# EAGLE design stm32_StepInveter_1904_01 (EAGLE 6.1)

## Sheet 1 of 4
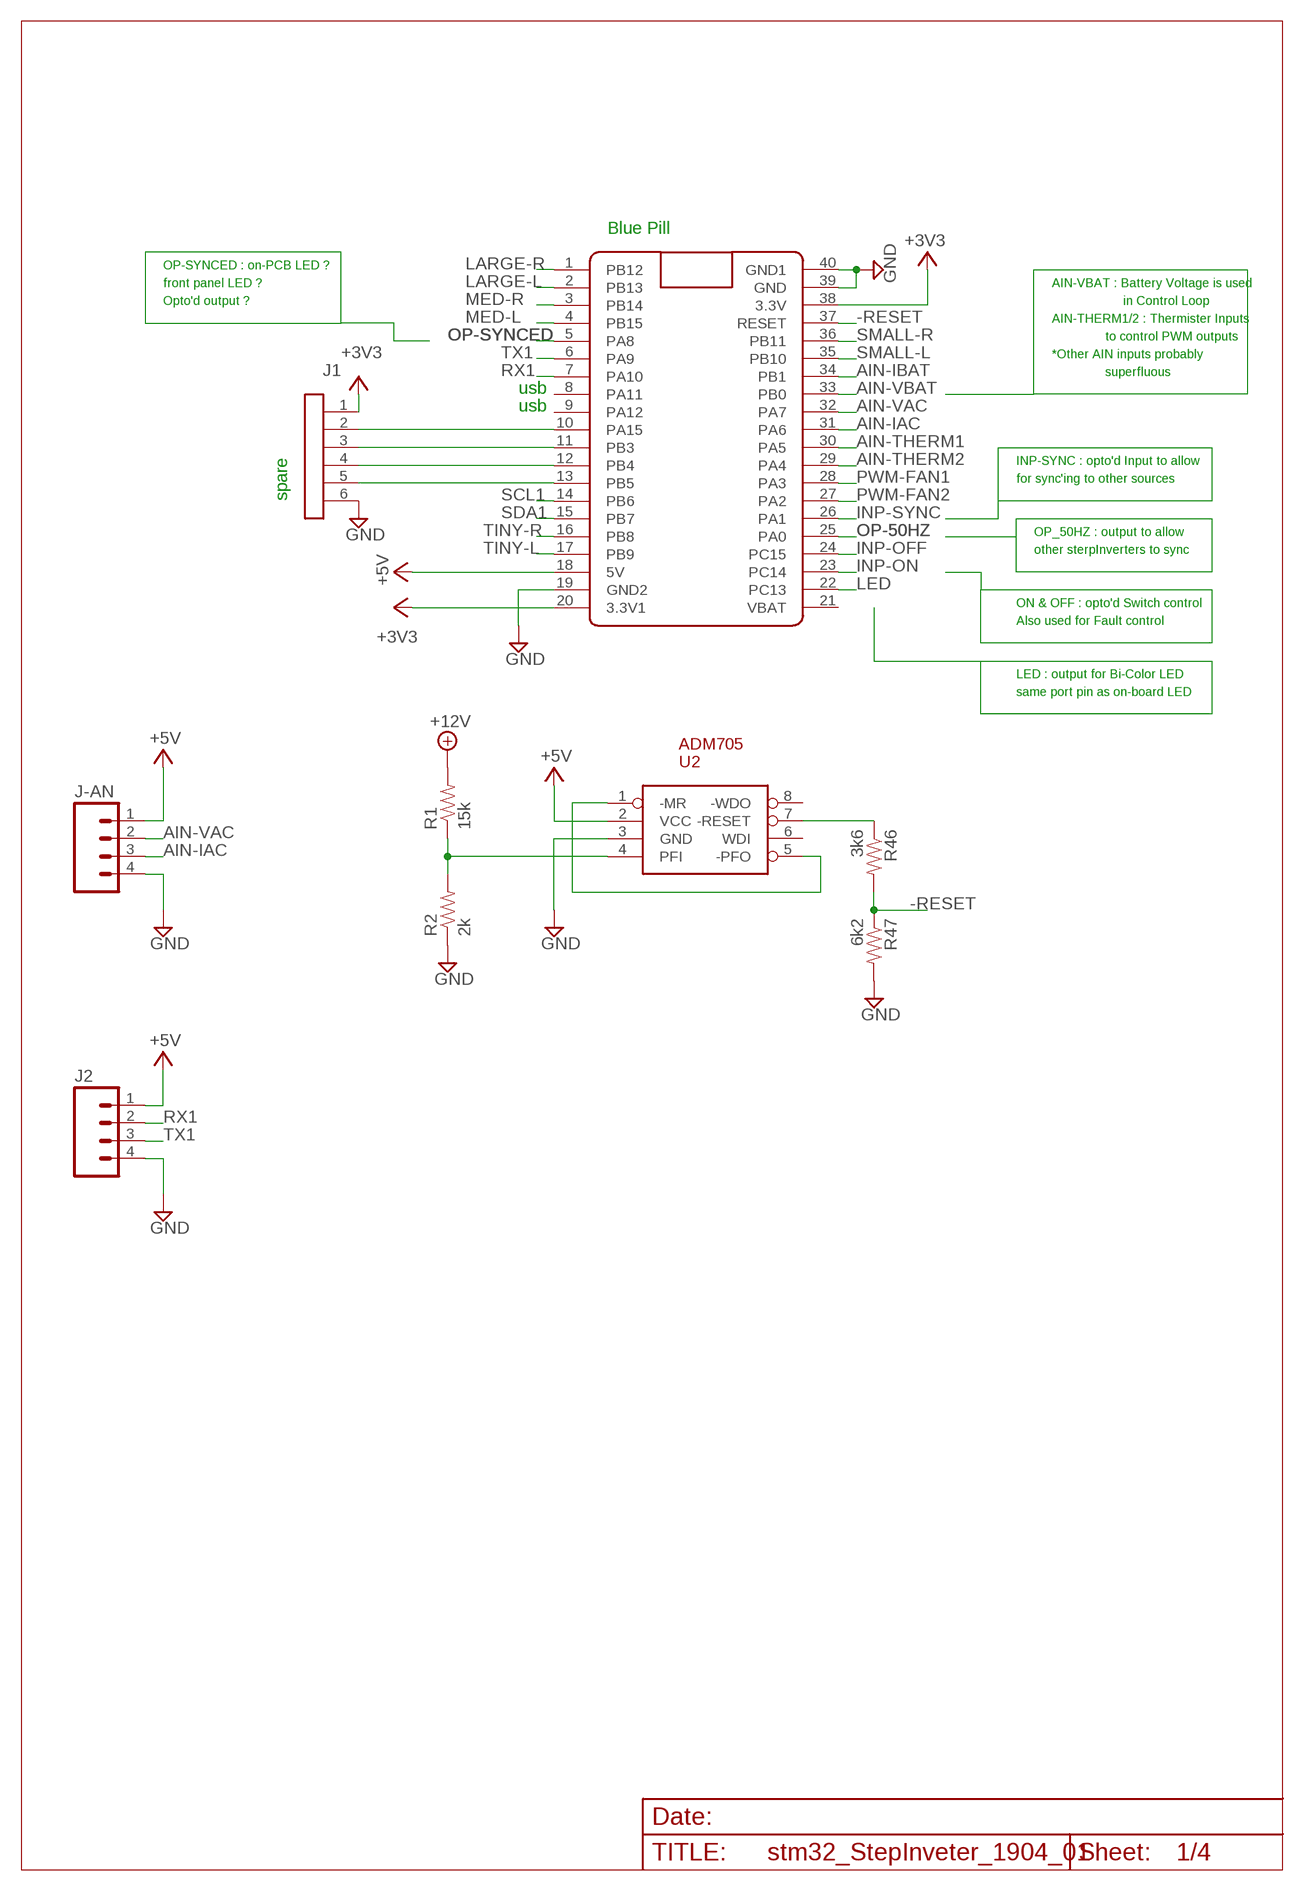
[diagram p0: schematic, sheet 1]

### Parts
J1  SIL-6  [SIL6]
J2  SIL4  [SIL4]
J-AN  SIL4  [SIL4]
R1  15k  R4  [AXIAL-0.4]
R2  2k  R4  [AXIAL-0.4]
R46  3k6  R4  [AXIAL-0.4]
R47  6k2  R4  [AXIAL-0.4]
U2  ADM705  [DIL08]
U$1  BLUE_PILL  [BLUE_PILL_CLEAN]

### Nets
+3V3: J1.1 U$1.20(3.3V1) U$1.38(3.3V) ; also sheet 3
+5V: J2.1 J-AN.1 U2.2(VCC) U$1.18(5V) ; also sheet 2,3,4
+12V: R1.P$2 ; also sheet 3
-RESET: R46.P$2 R47.P$1 U$1.37(RESET)
AIN-IAC: J-AN.3 U$1.31(PA6)
AIN-IBAT: U$1.34(PB1) ; also sheet 3
AIN-THERM1: U$1.30(PA5) ; also sheet 3
AIN-THERM2: U$1.29(PA4) ; also sheet 3
AIN-VAC: J-AN.2 U$1.32(PA7)
AIN-VBAT: U$1.33(PB0) ; also sheet 3
GND: J1.6 J2.4 J-AN.4 R2.P$1 R47.P$2 U2.3(GND) U$1.19(GND2) U$1.39(GND) U$1.40(GND1) ; also sheet 2,3,4
INP-OFF: U$1.24(PC15) ; also sheet 3
INP-ON: U$1.23(PC14) ; also sheet 3
INP-SYNC: U$1.26(PA1) ; also sheet 3
LARGE-L: U$1.2(PB13) ; also sheet 2
LARGE-R: U$1.1(PB12) ; also sheet 2
LED: U$1.22(PC13) ; also sheet 4
MED-L: U$1.4(PB15) ; also sheet 2
MED-R: U$1.3(PB14) ; also sheet 2
N$1: J1.2 U$1.10(PA15)
N$2: J1.3 U$1.11(PB3)
N$3: J1.4 U$1.12(PB4)
N$4: J1.5 U$1.13(PB5)
N$5: U2.1(-MR) U2.5(-PFO)
N$6: R1.P$1 R2.P$2 U2.4(PFI)
N$77: R46.P$1 U2.7(-RESET)
OP-50HZ: U$1.25(PA0) ; also sheet 4
OP-SYNCED: U$1.5(PA8) ; also sheet 4
PWM-FAN1: U$1.28(PA3) ; also sheet 4
PWM-FAN2: U$1.27(PA2) ; also sheet 4
RX1: J2.2 U$1.7(PA10)
SCL1: U$1.14(PB6)
SDA1: U$1.15(PB7)
SMALL-L: U$1.35(PB10) ; also sheet 2
SMALL-R: U$1.36(PB11) ; also sheet 2
TINY-L: U$1.17(PB9) ; also sheet 2
TINY-R: U$1.16(PB8) ; also sheet 2
TX1: J2.3 U$1.6(PA9)
Unconnected: U2.6(WDI) U2.8(-WDO) U$1.8(PA11) U$1.9(PA12) U$1.21(VBAT)

### Notes on the sheet
- Blue Pill
- OP-SYNCED : on-PCB LED ?
- front panel LED ? | AIN-VBAT : Battery Voltage is used
- Opto'd output ? | in Control Loop
- AIN-THERM1/2 : Thermister Inputs
- to control PWM outputs
- *Other AIN inputs probably
- superfluous
- usb
- usb
- INP-SYNC : opto'd Input to allow
- for sync'ing to other sources
- spare
- OP_50HZ : output to allow
- other sterpInverters to sync
- ON & OFF : opto'd Switch control
- Also used for Fault control
- LED : output for Bi-Color LED
- same port pin as on-board LED

## Sheet 2 of 4
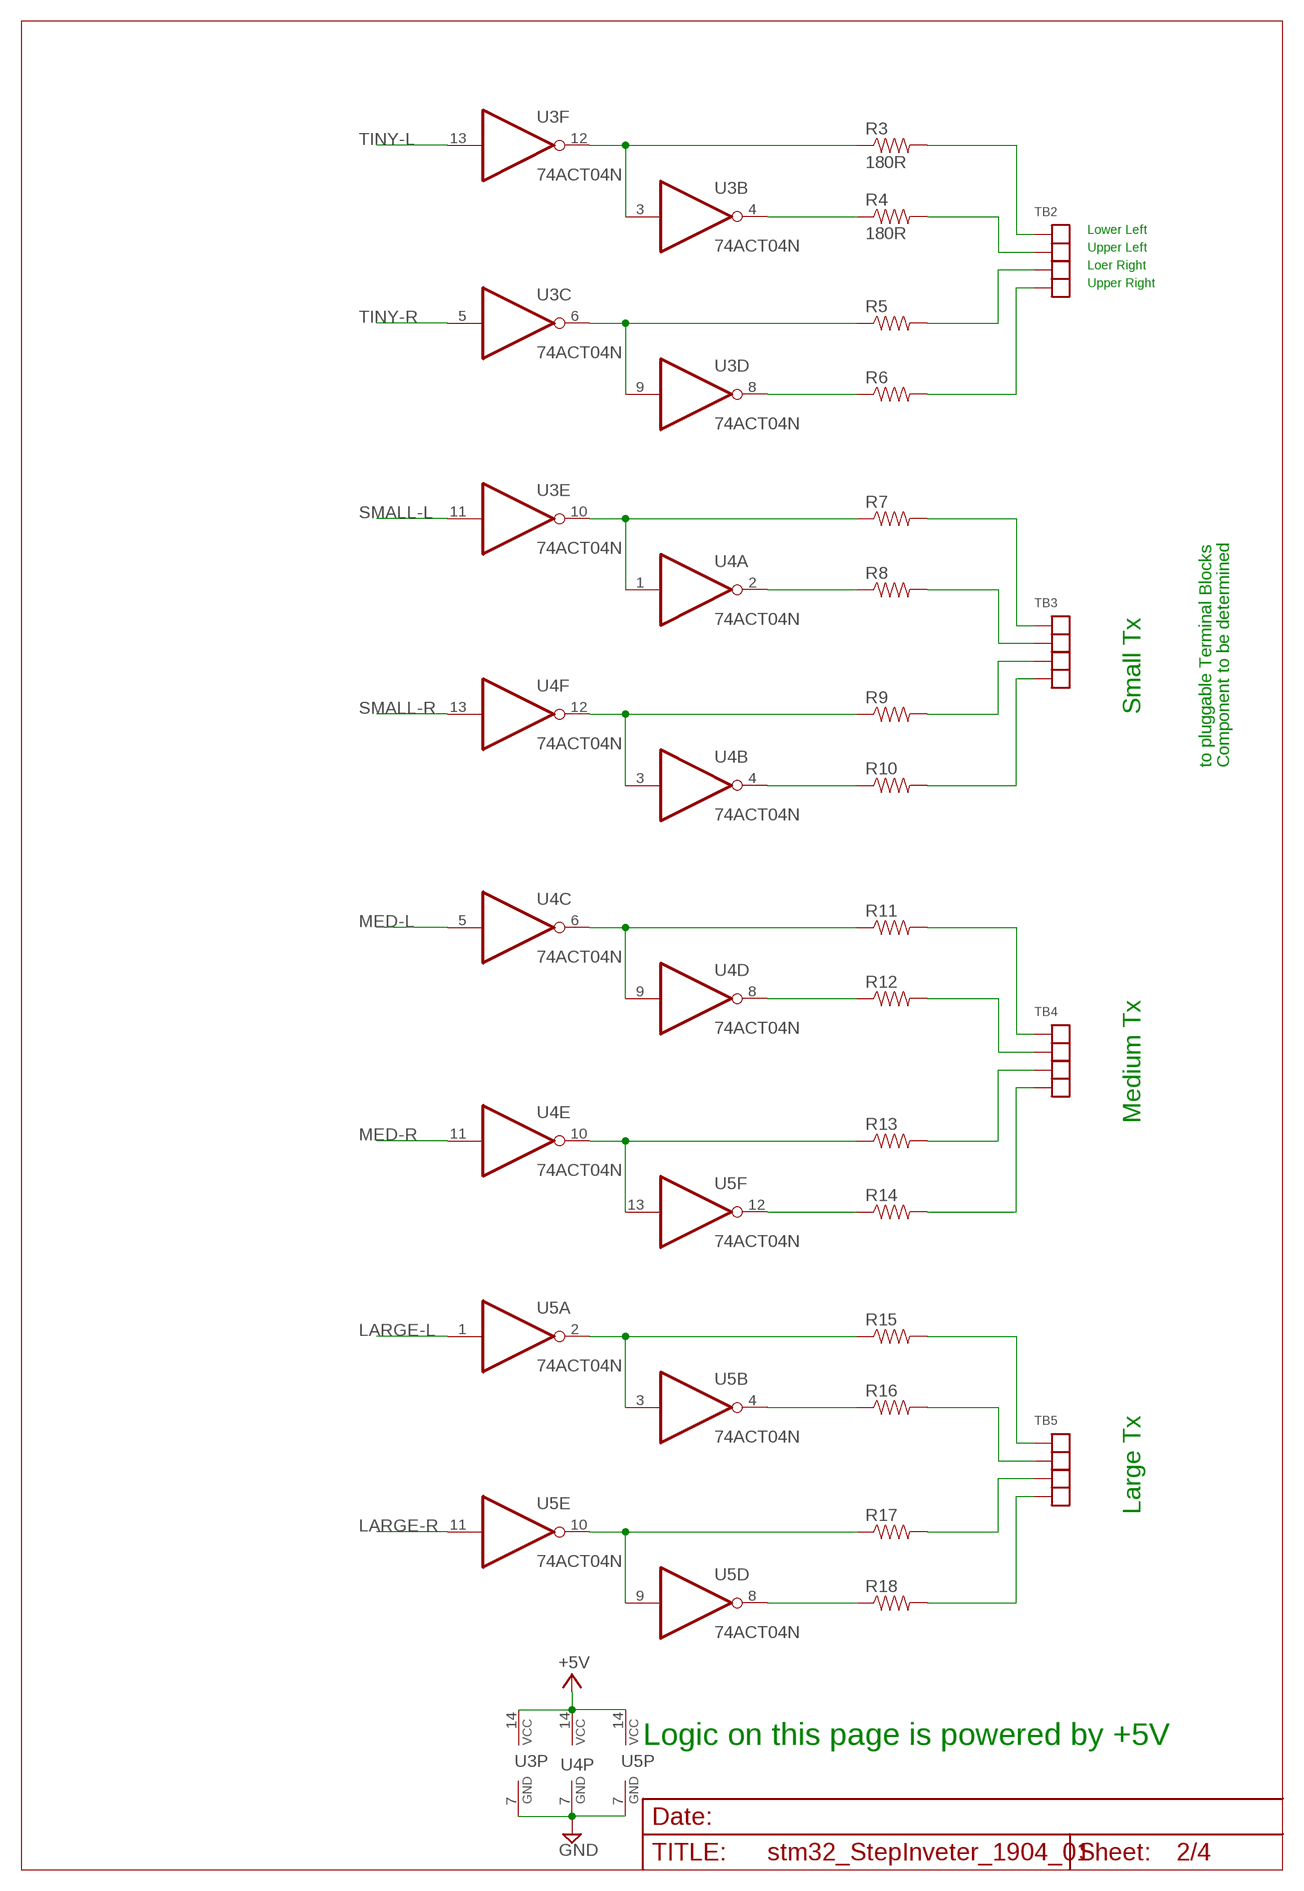
[diagram p1: schematic, sheet 2]

### Parts
R3  180R  R4  [AXIAL-0.4]
R4  180R  R4  [AXIAL-0.4]
R5  R4  [AXIAL-0.4]
R6  R4  [AXIAL-0.4]
R7  R4  [AXIAL-0.4]
R8  R4  [AXIAL-0.4]
R9  R4  [AXIAL-0.4]
R10  R4  [AXIAL-0.4]
R11  R4  [AXIAL-0.4]
R12  R4  [AXIAL-0.4]
R13  R4  [AXIAL-0.4]
R14  R4  [AXIAL-0.4]
R15  R4  [AXIAL-0.4]
R16  R4  [AXIAL-0.4]
R17  R4  [AXIAL-0.4]
R18  R4  [AXIAL-0.4]
TB2  TB4381_SIL  [TB-381-SIL-4P]
TB3  TB4381_SIL  [TB-381-SIL-4P]
TB4  TB4381_SIL  [TB-381-SIL-4P]
TB5  TB4381_SIL  [TB-381-SIL-4P]
U3  74ACT04N  [DIL14]
U4  74ACT04N  [DIL14]
U5  74ACT04N  [DIL14]

### Nets
+5V: U3.14(P:VCC) U4.14(P:VCC) U5.14(P:VCC) ; also sheet 1,3,4
GND: U3.7(P:GND) U4.7(P:GND) U5.7(P:GND) ; also sheet 1,3,4
LARGE-L: U5.1(A:I) ; also sheet 1
LARGE-R: U5.11(E:I) ; also sheet 1
MED-L: U4.5(C:I) ; also sheet 1
MED-R: U4.11(E:I) ; also sheet 1
N$15: R3.P$1 U3.3(B:I) U3.12(F:O)
N$16: R4.P$1 U3.4(B:O)
N$17: R5.P$1 U3.6(C:O) U3.9(D:I)
N$18: R6.P$1 U3.8(D:O)
N$19: R7.P$1 U3.10(E:O) U4.1(A:I)
N$20: R8.P$1 U4.2(A:O)
N$21: R9.P$1 U4.3(B:I) U4.12(F:O)
N$22: R10.P$1 U4.4(B:O)
N$23: R11.P$1 U4.6(C:O) U4.9(D:I)
N$24: R12.P$1 U4.8(D:O)
N$25: R13.P$1 U4.10(E:O) U5.13(F:I)
N$26: R14.P$1 U5.12(F:O)
N$27: R15.P$1 U5.2(A:O) U5.3(B:I)
N$28: R16.P$1 U5.4(B:O)
N$29: R17.P$1 U5.9(D:I) U5.10(E:O)
N$30: R18.P$1 U5.8(D:O)
N$40: R3.P$2 TB2.1 TB2.11
N$62: R4.P$2 TB2.2 TB2.12
N$63: R5.P$2 TB2.3 TB2.13
N$64: R6.P$2 TB2.4 TB2.14
N$65: R7.P$2 TB3.1 TB3.11
N$66: R8.P$2 TB3.2 TB3.12
N$67: R9.P$2 TB3.3 TB3.13
N$68: R10.P$2 TB3.4 TB3.14
N$69: R11.P$2 TB4.1 TB4.11
N$70: R12.P$2 TB4.2 TB4.12
N$71: R13.P$2 TB4.3 TB4.13
N$72: R14.P$2 TB4.4 TB4.14
N$73: R15.P$2 TB5.1 TB5.11
N$74: R16.P$2 TB5.2 TB5.12
N$75: R17.P$2 TB5.3 TB5.13
N$76: R18.P$2 TB5.4 TB5.14
SMALL-L: U3.11(E:I) ; also sheet 1
SMALL-R: U4.13(F:I) ; also sheet 1
TINY-L: U3.13(F:I) ; also sheet 1
TINY-R: U3.5(C:I) ; also sheet 1

### Notes on the sheet
- Lower Left
- Upper Left
- Loer Right
- Upper Right
- Small Tx
- to pluggable Terminal Blocks | Component to be determined
- Medium Tx
- Large Tx
- Logic on this page is powered by +5V

## Sheet 3 of 4
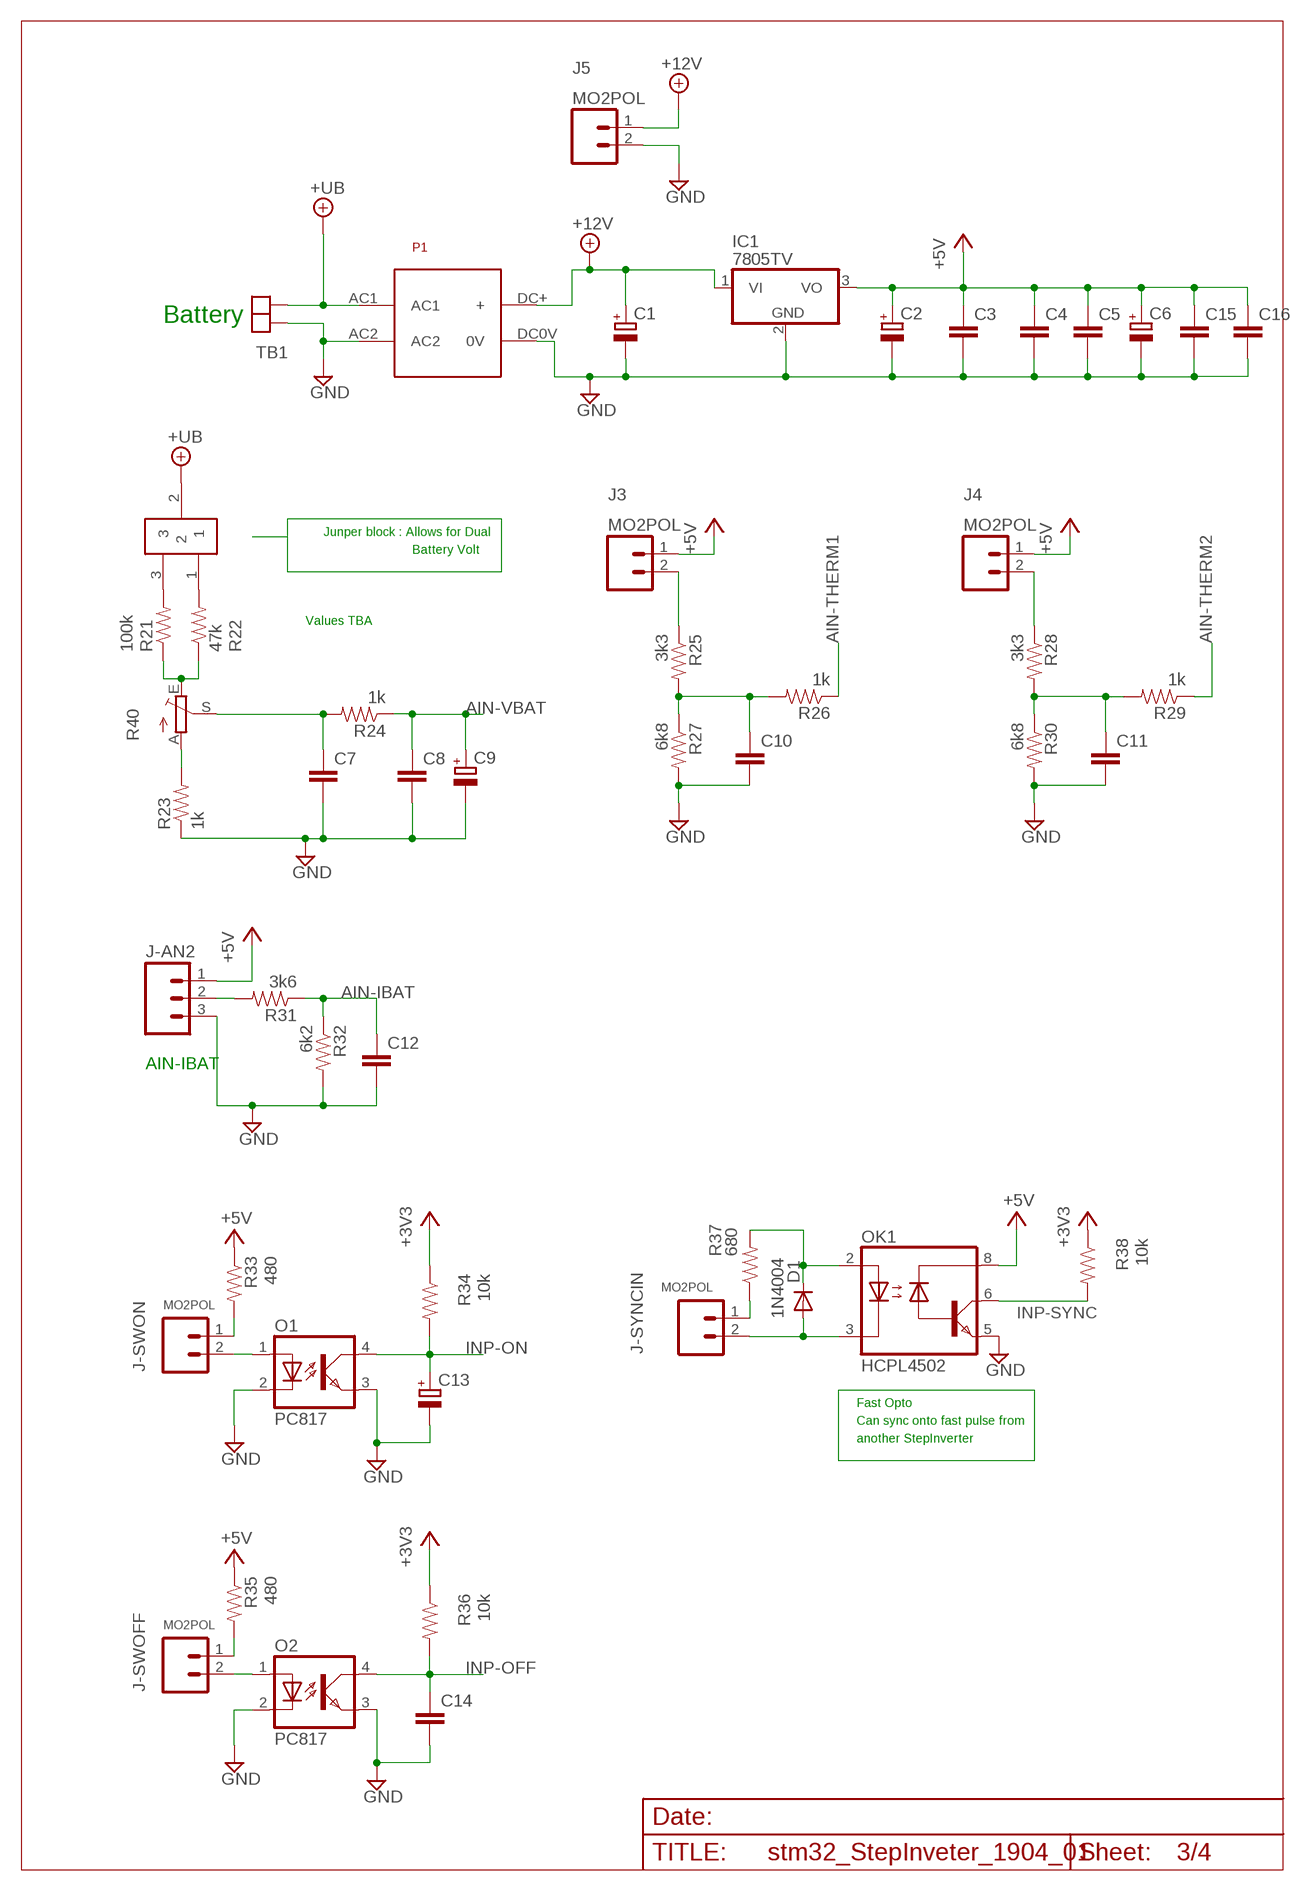
[diagram p2: schematic, sheet 3]

### Parts
C1  CPOL-EUE5-8.5  [E5-8,5]
C2  CPOL-EUE2.5-5  [E2,5-5]
C3  BCAP  [BCAP]
C4  BCAP  [BCAP]
C5  BCAP  [BCAP]
C6  CPOL-EUE2.5-5  [E2,5-5]
C7  BCAP  [BCAP]
C8  BCAP  [BCAP]
C9  CPOL-EUE2.5-5  [E2,5-5]
C10  BCAP  [BCAP]
C11  BCAP  [BCAP]
C12  BCAP  [BCAP]
C13  CPOL-EUE2.5-6  [E2,5-6]
C14  BCAP  [BCAP]
C15  BCAP  [BCAP]
C16  BCAP  [BCAP]
D1  1N4004  [DO41-10]
IC1  7805TV  [TO220V]
J3  MO2POL  [MOLEX-1X2]
J4  MO2POL  [MOLEX-1X2]
J5  MO2POL  [MOLEX-1X2]
J-AN2  MO3POL  [MOLEX-3]
J-SWOFF  MO2POL  [MOLEX-1X2]
J-SWON  MO2POL  [MOLEX-1X2]
J-SYNCIN  MO2POL  [MOLEX-1X2]
JP1  JP1X3  [JP1X3]
O1  PC817  [DIL04]
O2  PC817  [DIL04]
OK1  HCPL4502  [DIL08]
P1  ACDC  [ACDC]
R21  100k  R4  [AXIAL-0.4]
R22  47k  R4  [AXIAL-0.4]
R23  1k  R4  [AXIAL-0.4]
R24  1k  R4  [AXIAL-0.4]
R25  3k3  R4  [AXIAL-0.4]
R26  1k  R4  [AXIAL-0.4]
R27  6k8  R4  [AXIAL-0.4]
R28  3k3  R4  [AXIAL-0.4]
R29  1k  R4  [AXIAL-0.4]
R30  6k8  R4  [AXIAL-0.4]
R31  3k6  R4  [AXIAL-0.4]
R32  6k2  R4  [AXIAL-0.4]
R33  480  R4  [AXIAL-0.4]
R34  10k  R4  [AXIAL-0.4]
R35  480  R4  [AXIAL-0.4]
R36  10k  R4  [AXIAL-0.4]
R37  680  R4  [AXIAL-0.4]
R38  10k  R4  [AXIAL-0.4]
R40  TRIM_EU-B64Y  [B64Y]
TB1  TB2381  [TB-KF2EDG381-2P]

### Nets
+3V3: R34.P$1 R36.P$1 R38.P$1 ; also sheet 1
+5V: C2.+ C3.1 C4.1 C5.1 C6.+ C15.1 C16.1 IC1.3(VO) J3.1 J4.1 J-AN2.1 OK1.8(VCC) R33.P$1 R35.P$1 ; also sheet 1,2,4
+12V: C1.+ IC1.1(VI) J5.1 P1.DC+(+) ; also sheet 1
+UB: JP1.2 P1.AC1 TB1.1
AIN-IBAT: C12.1 R31.P$1 R32.P$1 ; also sheet 1
AIN-THERM1: R26.P$1 ; also sheet 1
AIN-THERM2: R29.P$1 ; also sheet 1
AIN-VBAT: C8.1 C9.+ R24.P$1 ; also sheet 1
GND: C1.- C2.- C3.2 C4.2 C5.2 C6.- C7.2 C8.2 C9.- C10.2 C11.2 C12.2 C13.- C14.2 C15.2 C16.2 IC1.2(GND) J5.2 J-AN2.3 O1.2(C) O1.3(EMIT) O2.2(C) O2.3(EMIT) OK1.5(GND) P1.AC2 P1.DC0V(0V) R23.P$1 R27.P$2 R30.P$2 R32.P$2 TB1.2 ; also sheet 1,2,4
INP-OFF: C14.1 O2.4(COL) R36.P$2 ; also sheet 1
INP-ON: C13.+ O1.4(COL) R34.P$2 ; also sheet 1
INP-SYNC: OK1.6(VO) R38.P$2 ; also sheet 1
N$14: JP1.3 R21.P$2
N$32: JP1.1 R22.P$2
N$34: R21.P$1 R22.P$1 R40.E
N$35: C10.1 R25.P$2 R26.P$2 R27.P$1
N$36: J4.2 R28.P$1
N$37: J3.2 R25.P$1
N$38: C11.1 R28.P$2 R29.P$2 R30.P$1
N$39: J-SWON.1 R33.P$2
N$41: J-AN2.2 R31.P$2
N$42: J-SWON.2 O1.1(A)
N$43: J-SYNCIN.1 R37.P$1
N$44: D1.A J-SYNCIN.2 OK1.3(C)
N$45: J-SWOFF.1 R35.P$2
N$46: J-SWOFF.2 O2.1(A)
N$47: D1.C OK1.2(A) R37.P$2
N$82: C7.1 R24.P$2 R40.S
N$84: R23.P$2 R40.A

### Notes on the sheet
- Battery
- Junper block : Allows for Dual
- Battery Volt
- Values TBA
- AIN-IBAT
- Fast Opto
- Can sync onto fast pulse from
- another StepInverter

## Sheet 4 of 4
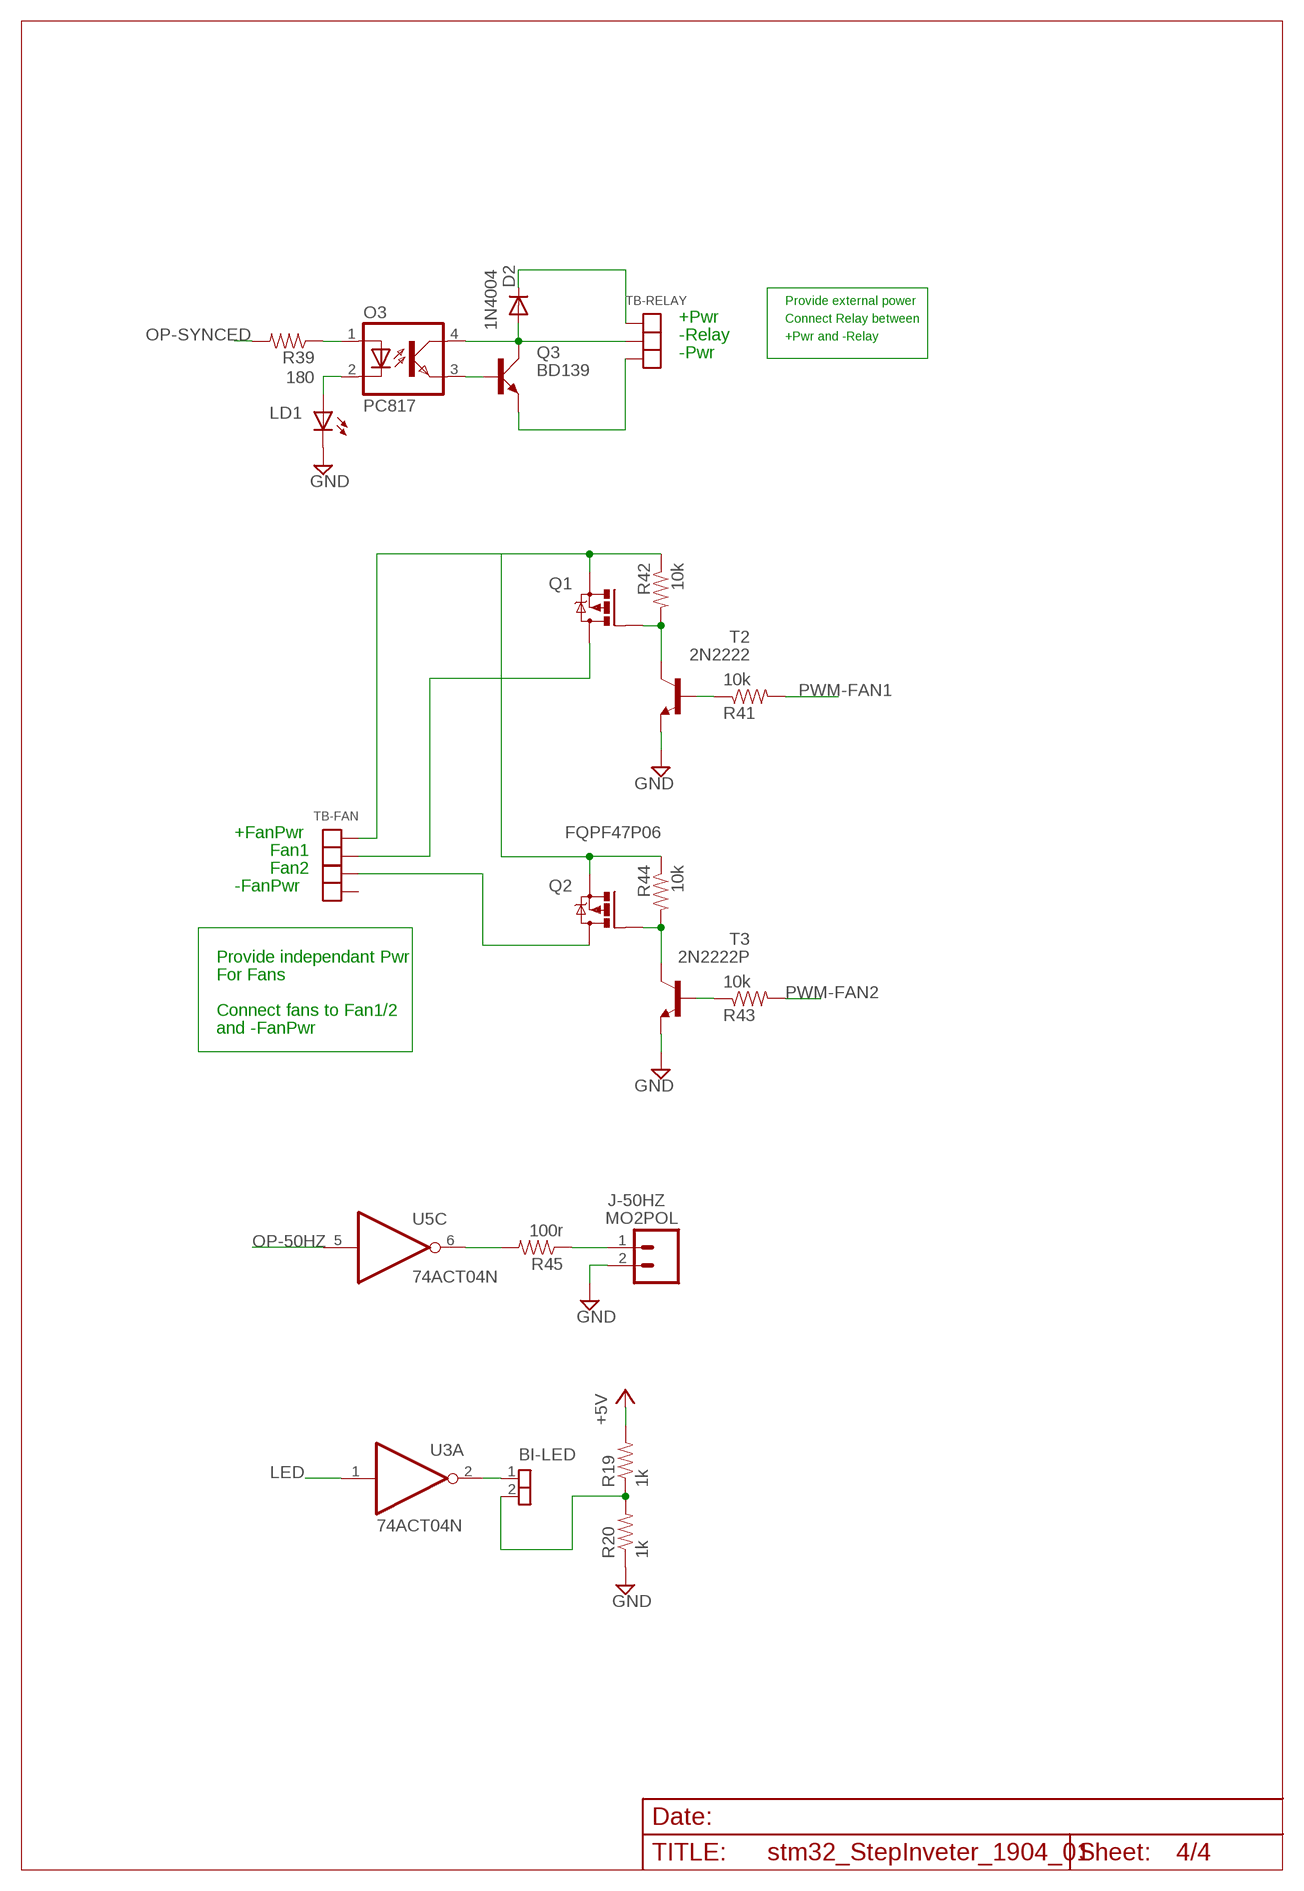
[diagram p3: schematic, sheet 4]

### Parts
BI-LED  SIL-2  [JP1]
D2  1N4004  [DO41-10]
J-50HZ  MO2POL  [MOLEX-1X2]
LD1  LED3MM  [LED3MM]
O3  PC817  [DIL04]
Q1  MOSFET-PCHFQPF47P06  [TO220BV]
Q2  FQPF47P06  MOSFET-PCHFQPF47P06  [TO220BV]
Q3  BD139  [TO126AV]
R19  1k  R4  [AXIAL-0.4]
R20  1k  R4  [AXIAL-0.4]
R39  180  R4  [AXIAL-0.4]
R41  10k  R4  [AXIAL-0.4]
R42  10k  R4  [AXIAL-0.4]
R43  10k  R4  [AXIAL-0.4]
R44  10k  R4  [AXIAL-0.4]
R45  100r  R4  [AXIAL-0.4]
T2  2N2222  2N2222P  [TO92/]
T3  2N2222P  [TO92/]
TB-FAN  TB4  [TB-KF2EDG381-4P]
TB-RELAY  TB3381  [TB-KF2EDG381-3P]

### Nets
+5V: R19.P$2 ; also sheet 1,2,3
GND: J-50HZ.2 LD1.K(C) R20.P$1 T2.1(E) T3.1(E) ; also sheet 1,2,3
LED: U3.1(A:I) ; also sheet 1
N$7: BI-LED.2 R19.P$1 R20.P$2
N$8: BI-LED.1 U3.2(A:O)
N$49: LD1.A O3.2(C)
N$50: O3.1(A) R39.P$1
N$51: Q1.G R42.P$2 T2.3(C)
N$52: O3.3(EMIT) Q3.B
N$53: R41.P$1 T2.2(B)
N$54: Q1.S Q2.S R42.P$1 R44.P$1 TB-FAN.1
N$55: Q2.G R44.P$2 T3.3(C)
N$56: R45.P$2 U5.6(C:O)
N$57: Q1.D TB-FAN.2
N$58: R43.P$1 T3.2(B)
N$59: J-50HZ.1 R45.P$1
N$60: Q2.D TB-FAN.3
N$78: D2.A O3.4(COL) Q3.C TB-RELAY.2
N$79: D2.C TB-RELAY.1
N$81: Q3.E TB-RELAY.3
OP-50HZ: U5.5(C:I) ; also sheet 1
OP-SYNCED: R39.P$2 ; also sheet 1
PWM-FAN1: R41.P$2 ; also sheet 1
PWM-FAN2: R43.P$2 ; also sheet 1
Unconnected: TB-FAN.4

### Notes on the sheet
- Provide external power
- +Pwr | Connect Relay between
- -Relay | +Pwr and -Relay
- -Pwr
- +FanPwr
- Fan1
- Fan2
- -FanPwr
- Provide independant Pwr
- For Fans
- Connect fans to Fan1/2
- and -FanPwr

## Library data of the parts
BI-LED = Andrew_Connectors:SIL-2
C1 C2 C6 C9 C13 = rcl:CPOL-EU: POLARIZED CAPACITOR, European symbol
C3-C5 C7 C8 C10-C12 C14-C16 = Andrew Misc:BCAP
D1 D2 = diode:1N4004: DIODE general purpose rectifier, 1 A
IC1 = Andrew Linear:78*: Positive VOLTAGE REGULATOR Source: http://cache.national.com/ds/LM/LM78L05.pdf http://www.fairchildsemi.com/ds/LM/LM7805.pdf
J1 = Andrew_Connectors:SIL-6
J2 J-AN = Andrew_Connectors:SIL4
J3-J5 J-50HZ J-SWOFF J-SWON J-SYNCIN = Andrew_Connectors:MO2POL
J-AN2 = Andrew_Connectors:MO3POL
JP1 = Andrew_Connectors:JP1X3
LD1 = led:LED: LED OSRAM: - CHIPLED LG R971, LG N971, LY N971, LG Q971, LY Q971, LO R971, LY R971 LH N974, LH R974 LS Q976, LO Q976, LY Q976 LO Q996 - Hyper CHIPLED LW Q18S LB Q993, LB Q99A, LB R99A - SideLED LS A670, LO A670, LY A670, LG A670, LP A670 LB A673, LV A673, LT A673, LW A673 LH A674 LY A675 LS A676, LA A676, LO A676, LY A676, LW A676 LS A679, LY A679, LG A679 - Hyper Micro SIDELED® LS Y876, LA Y876, LO Y876, LY Y876 LT Y87S - SmartLED LW L88C, LW L88S LB L89C, LB L89S, LG L890 LS L89K, LO L89K, LY L89K LS L896, LA L896, LO L896, LY L896 - TOPLED LS T670, LO T670, LY T670, LG T670, LP T670 LSG T670, LSP T670, LSY T670, LOP T670, LYG T670 LG T671, LOG T671, LSG T671 LB T673, LV T673, LT T673, LW T673 LH T674 LS T676, LA T676, LO T676, LY T676, LB T676, LH T676, LSB T676, LW T676 LB T67C, LV T67C, LT T67C, LS T67K, LO T67K, LY T67K, LW E67C LS E67B, LA E67B, LO E67B, LY E67B, LB E67C, LV E67C, LT E67C LW T67C LS T679, LY T679, LG T679 LS T770, LO T770, LY T770, LG T770, LP T770 LB T773, LV T773, LT T773, LW T773 LH T774 LS E675, LA E675, LY E675, LS T675 LS T776, LA T776, LO T776, LY T776, LB T776 LHGB T686 LT T68C, LB T68C - Hyper Mini TOPLED® LB M676 - Mini TOPLED Santana® LG M470 LS M47K, LO M47K, LY M47K Source: http://www.osram.convergy.de LUXEON: - LUMILED® LXK2-PW12-R00, LXK2-PW12-S00, LXK2-PW14-U00, LXK2-PW14-V00 LXK2-PM12-R00, LXK2-PM12-S00, LXK2-PM14-U00 LXK2-PE12-Q00, LXK2-PE12-R00, LXK2-PE12-S00, LXK2-PE14-T00, LXK2-PE14-U00 LXK2-PB12-K00, LXK2-PB12-L00, LXK2-PB12-M00, LXK2-PB14-N00, LXK2-PB14-P00, LXK2-PB14-Q00 LXK2-PR12-L00, LXK2-PR12-M00, LXK2-PR14-Q00, LXK2-PR14-R00 LXK2-PD12-Q00, LXK2-PD12-R00, LXK2-PD12-S00 LXK2-PH12-R00, LXK2-PH12-S00 LXK2-PL12-P00, LXK2-PL12-Q00, LXK2-PL12-R00 Source: www.luxeon.com KINGBRIGHT: KA-3528ASYC Source: www.kingbright.com
O1-O3 = Andrew:PC817: SHARP OPTO COUPLER; MPN: PC817X4J000F; OC_FARNELL: 9707727; OC_NEWARK: 97K7059
OK1 = optocoupler:HCPL4502: HEWLETT PACKARD OPTO COUPLER; MF: AGILENT TECHNOLOGIES; MPN: HCPL-4502-000E; OC_FARNELL: 9994777; OC_NEWARK: 31K7017
P1 = Andrew ISOPWR:ACDC
Q1 Q2 = Andrew Transistor:MOSFET-PCH: P-CHANNEL HEXFET POWER-MOS-FET Source: http://www.irf.com/product-info/datasheets/data/irf9530.pdf
Q3 = transistor-power:BD139: NPN TRANSISTOR
R1-R39 R41-R47 = Andrew Misc:R4
R40 = pot:TRIM_EU-: POTENTIOMETER
T2 T3 = Andrew Transistor:2N2222: NPN TRANSISTOR
TB1 = Andrew_Connectors:TB2
TB2-TB5 TB-FAN = Andrew_Connectors:TB4
TB-RELAY = Andrew_Connectors:TB3
U2 = Andrew IC:ADM705
U3-U5 = 74xx-eu:74*04: Hex INVERTER
U$1 = Andrew_BluePill_Scope:BLUE_PILL

## Board
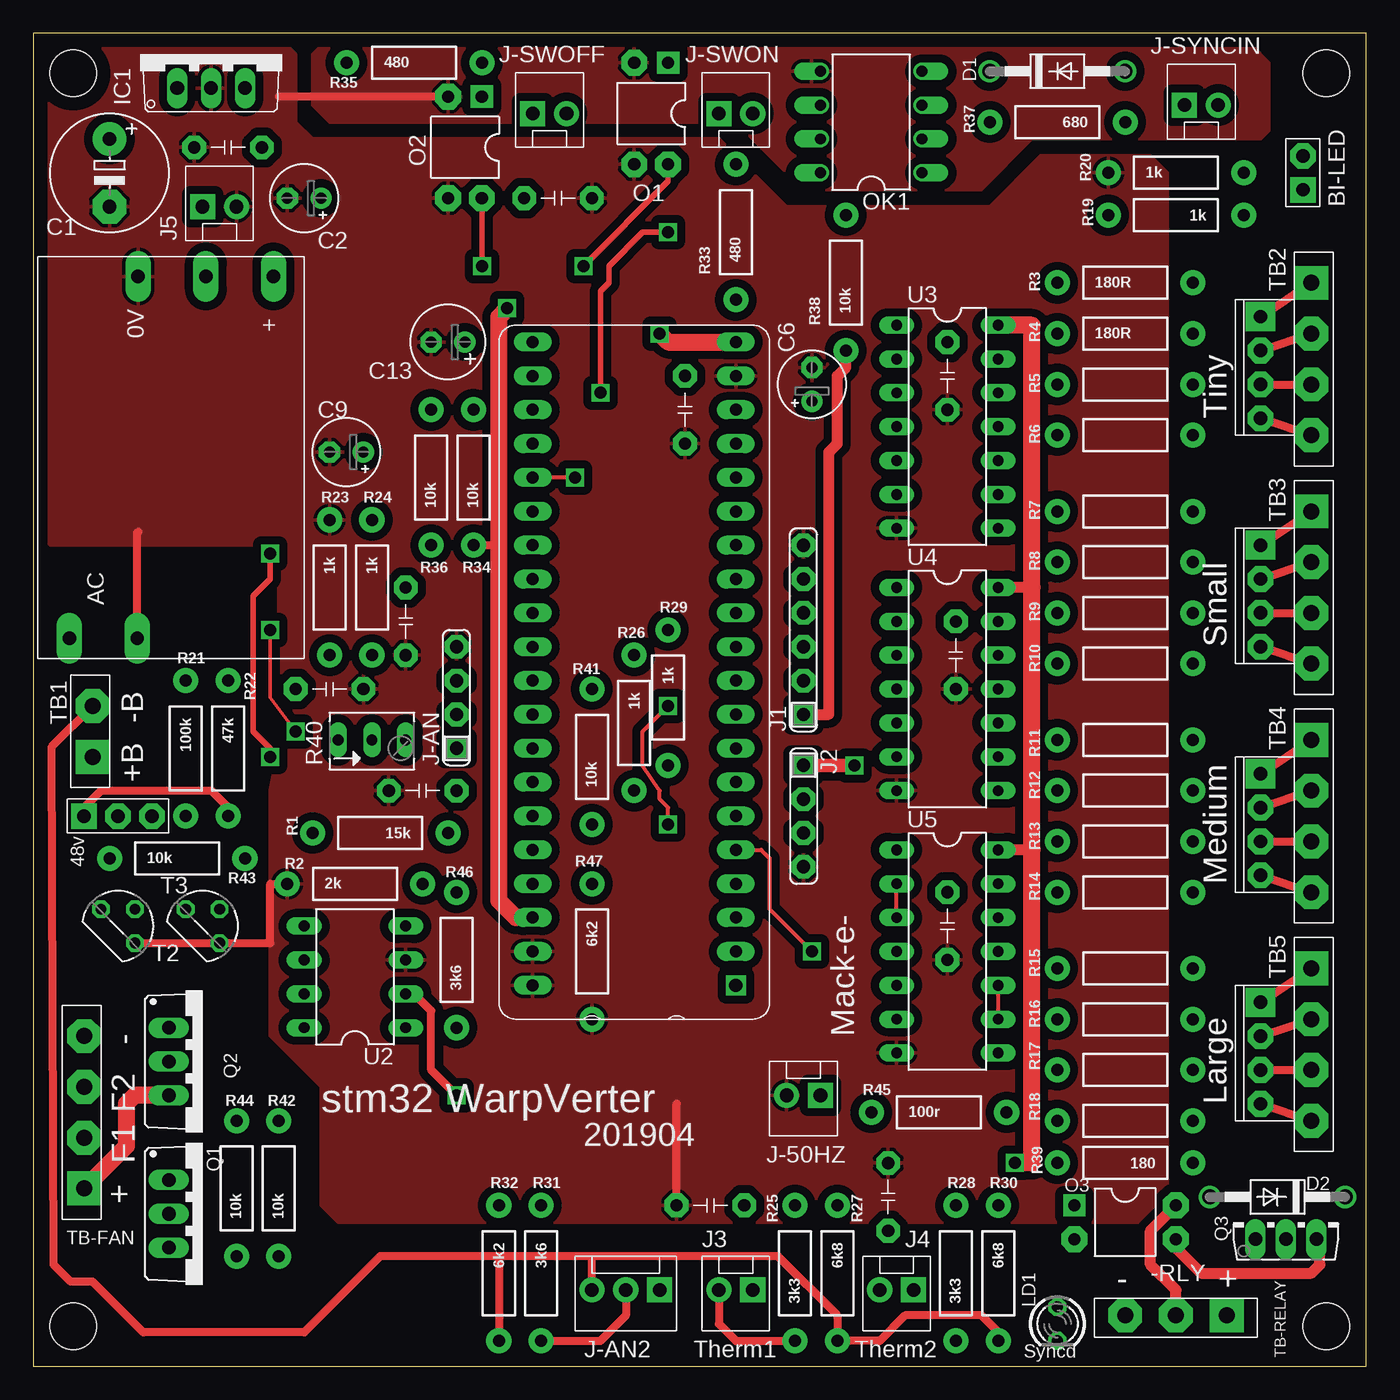
[diagram p4: board, top side]
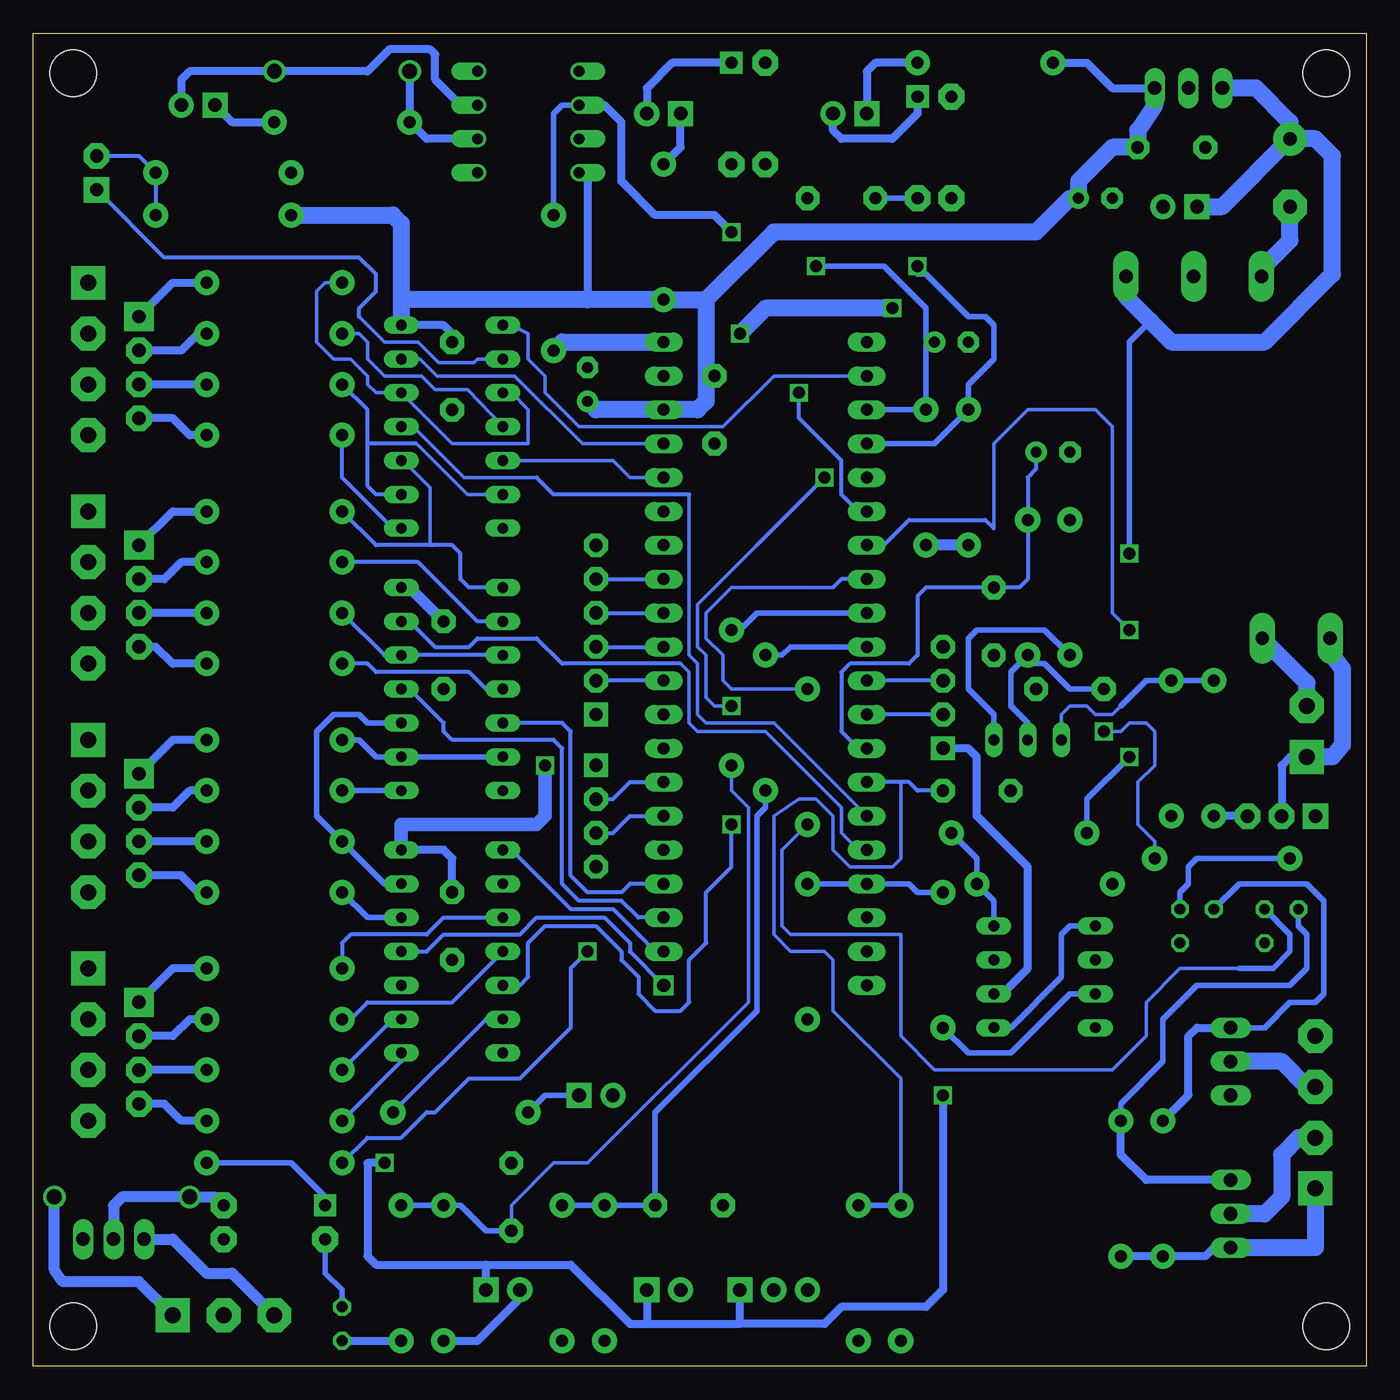
[diagram p5: board, bottom side, seen from below]

Size 100 x 100 mm. Coordinates in mm from the lower left corner, seen from the top.
Outline: 0,0 100,0 100,100 0,100 0,0
Copper layers (1*16): Top 0.035mm / dielectric 1.5mm / Bottom 0.035mm
Design rules: minimum track width 10mil, minimum drill 24mil, track to track 8mil, track to pad 8mil, pad to pad 8mil, via to via 8mil, smd to smd 8mil, copper to edge 40mil, drill to drill 8mil, minimum pad ring 10mil, minimum via ring 8mil, stop-mask expansion 4mil, vias tented up to drill 0mil, thermal gap 10mil
Holes 3.5 mm at 3,3 3,97 97,97 97,3

### Footprints (pad centres in the part's own frame; a part is rotated, then mirrored left to right if it is on the bottom)
JP1 = drill 1 pad 1.905 square: 1 -1.27,0 | drill 1 pad 1.905 octagon: 2 1.27,0
E5-8,5 = drill 1.016 pad 2.54: + -2.54,0 | drill 1.016 pad 2.54 octagon: - 2.54,0
E2,5-5 = drill 0.813 pad 1.6: + -1.27,0 | drill 0.813 pad 1.6 octagon: - 1.27,0
BCAP = drill 0.914 pad 1.778 octagon: 1 -2.54,0; 2 2.54,0
E2,5-6 = drill 0.813 pad 1.6: + -1.27,0 | drill 0.813 pad 1.6 octagon: - 1.27,0
DO41-10 = drill 1.118: A 5.08,0; C -5.08,0
TO220V = drill 1.016 long: 1 -2.54,-2.54; 2 0,-2.54; 3 2.54,-2.54
SIL6 = drill 1 pad 1.778 square: 1 -6.35,0 | drill 1 pad 1.778 octagon: 2 -3.81,0; 3 -1.27,0; 4 1.27,0; 5 3.81,0; 6 6.35,0
SIL4 = drill 1 pad 1.778 square: 1 0,0 | drill 1 pad 1.778 octagon: 2 2.54,0; 3 5.08,0; 4 7.62,0
MOLEX-1X2 = drill 1.016 pad 1.88 square: 1 0,0 | drill 1.016 pad 1.88: 2 2.54,0
MOLEX-3 = drill 1.016 pad 1.88 square: 1 -2.54,0 | drill 1.016 pad 1.88: 2 0,0; 3 2.54,0
JP1X3 = drill 1 pad 1.905 square: 1 -2.54,0 | drill 1 pad 1.905 octagon: 2 0,0; 3 2.54,0
LED3MM = drill 0.813 octagon: A -1.27,0; K 1.27,0
DIL04 = drill 0.914 pad 1.676 square: 1 -1.27,-3.81 | drill 0.914 pad 1.93 octagon: 2 1.27,-3.81; 3 1.27,3.81; 4 -1.27,3.81
DIL08 = drill 0.813 offset: 1 -3.81,-3.81; 2 -1.27,-3.81; 3 1.27,-3.81; 4 3.81,-3.81; 5 3.81,3.81; 6 1.27,3.81; 7 -1.27,3.81; 8 -3.81,3.81
ACDC = drill 1 pad 1.93 long: 4 27.15,7.38; AC1 0,17.61; AC2 0,12.53; DC0V 27.15,12.46; DC+ 27.15,2.3
TO220BV = drill 1.016 long: D 0,-2.54; G -2.54,-2.54; S 2.54,-2.54
TO126AV = drill 1.016 long: B 2.286,-1.27; C 0,-1.27; E -2.286,-1.27
AXIAL-0.4 = drill 0.9 pad 1.88: P$1 -5.08,0; P$2 5.08,0
B64Y = drill 0.813 long: A 2.54,0; E -2.54,0; S 0,0
TO92/ = drill 0.813 octagon: 1 1.27,-1.27; 2 1.27,1.27; 3 -1.27,1.27
TB-KF2EDG381-2P = drill 1.2 pad 2.54 square: 1 0,0 | drill 1.2 pad 2.54 octagon: 2 3.81,0
TB-381-SIL-4P = drill 1.2 pad 2.54 square: 1 0,0 | drill 1.2 pad 2.54 octagon: 2 3.81,0; 3 7.62,0; 4 11.43,0 | drill 1 pad 2.184 square: 11 2.54,-3.81 | drill 1 pad 1.93 octagon: 12 5.08,-3.81; 13 7.62,-3.81; 14 10.16,-3.81
TB-KF2EDG381-4P = drill 1.2 pad 2.54 square: 1 0,0 | drill 1.2 pad 2.54 octagon: 2 3.81,0; 3 7.62,0; 4 11.43,0
TB-KF2EDG381-3P = drill 1.2 pad 2.54 square: 1 0,0 | drill 1.2 pad 2.54 octagon: 2 3.81,0; 3 7.62,0
DIL08' = drill 0.813 long: 1 -3.81,-3.81; 2 -1.27,-3.81; 3 1.27,-3.81; 4 3.81,-3.81; 5 3.81,3.81; 6 1.27,3.81; 7 -1.27,3.81; 8 -3.81,3.81
DIL14 = drill 0.813 long: 1 -7.62,-3.81; 2 -5.08,-3.81; 3 -2.54,-3.81; 4 0,-3.81; 5 2.54,-3.81; 6 5.08,-3.81; 7 7.62,-3.81; 8 7.62,3.81; 9 5.08,3.81; 10 2.54,3.81; 11 0,3.81; 12 -2.54,3.81; 13 -5.08,3.81; 14 -7.62,3.81
BLUE_PILL_CLEAN = drill 1 square: 1 0,0 | drill 0.9 long: 2 0,-2.54; 3 0,-5.08; 4 0,-7.62; 5 0,-10.16; 6 0,-12.7; 7 0,-15.24; 8 0,-17.78; 9 0,-20.32; 10 0,-22.86; 11 0,-25.4; 12 0,-27.94; 13 0,-30.48; 14 0,-33.02; 15 0,-35.56; 16 0,-38.1; 17 0,-40.64; 18 0,-43.18; 19 0,-45.72; 20 0,-48.26; 21 15.24,-48.26; 22 15.24,-45.72; 23 15.24,-43.18; 24 15.24,-40.64; 25 15.24,-38.1; 26 15.24,-35.56; 27 15.24,-33.02; 28 15.24,-30.48; 29 15.24,-27.94; 30 15.24,-25.4; 31 15.24,-22.86; 32 15.24,-20.32; 33 15.24,-17.78; 34 15.24,-15.24; 35 15.24,-12.7; 36 15.24,-10.16; 37 15.24,-7.62; 38 15.24,-5.08; 39 15.24,-2.54; 40 15.24,0

### Placement (x,y rotation side)
BI-LED  95.25,89.53 90 top
C1  5.71,89.53 270 top
C2  20.32,87.63 180 top
C3  68.58,33.02 270 top
C4  14.61,91.44 180 top
C5  48.9,71.75 270 top
C6  58.42,73.66 90 top
C7  22.23,50.8 0 top
C8  27.94,55.88 270 top
C9  23.5,68.58 180 top
C10  50.8,12.06 180 top
C11  64.14,12.7 90 top
C12  29.21,43.18 180 top
C13  31.11,76.83 180 top
C14  39.37,87.63 0 top
C15  68.58,74.3 270 top
C16  69.22,53.34 270 top
D1  76.83,97.16 0 top
D2  93.34,12.7 180 top
IC1  13.34,98.42 0 top
J1  57.78,55.24 90 top
J2  57.78,45.09 270 top
J3  53.98,5.71 180 top
J4  66.04,5.71 180 top
J5  12.7,87 0 top
J-50HZ  59.05,20.32 180 top
J-AN  31.75,46.35 90 top
J-AN2  44.45,5.71 180 top
J-SWOFF  37.47,93.98 0 top
J-SWON  51.44,93.98 0 top
J-SYNCIN  86.36,94.61 0 top
JP1  6.35,41.27 0 top
LD1  76.83,3.17 270 top
O1  46.35,93.98 180 top
O2  32.38,91.44 180 top
O3  81.92,10.79 270 top
OK1  62.87,93.34 90 top
P1  20.32,54.61 90 top
Q1  12.7,11.43 270 top
Q2  12.7,22.86 270 top
Q3  93.98,10.79 0 top
R1  26.04,40.01 180 top
R2  24.13,36.2 0 top
R3  81.92,81.28 0 top
R4  81.92,77.47 0 top
R5  81.92,73.66 0 top
R6  81.92,69.85 0 top
R7  81.92,64.14 0 top
R8  81.92,60.33 0 top
R9  81.92,56.52 0 top
R10  81.92,52.7 0 top
R11  81.92,46.99 0 top
R12  81.92,43.18 0 top
R13  81.92,39.37 0 top
R14  81.92,35.56 0 top
R15  81.92,29.84 0 top
R16  81.92,26.04 0 top
R17  81.92,22.23 0 top
R18  81.92,18.41 0 top
R19  85.72,86.36 180 top
R20  85.72,89.53 0 top
R21  11.43,46.35 270 top
R22  14.61,46.35 270 top
R23  22.23,58.42 270 top
R24  25.4,58.42 270 top
R25  57.15,6.99 90 top
R26  45.09,48.26 270 top
R27  60.33,6.99 270 top
R28  69.22,6.99 90 top
R29  47.62,50.16 270 top
R30  72.39,6.99 270 top
R31  38.1,6.99 270 top
R32  34.92,6.99 270 top
R33  52.7,85.09 90 top
R34  33.02,66.67 90 top
R35  28.57,97.79 0 top
R36  29.84,66.67 90 top
R37  76.83,93.34 180 top
R38  60.96,81.28 90 top
R39  81.92,15.24 180 top
R40  25.4,46.99 0 top
R41  41.91,45.72 90 top
R42  18.41,13.34 90 top
R43  10.79,38.1 0 top
R44  15.24,13.34 90 top
R45  67.94,19.05 0 top
R46  31.75,30.48 90 top
R47  41.91,31.11 270 top
T2  6.35,33.02 0 top
T3  12.7,33.02 0 top
TB1  4.45,45.72 90 top
TB2  95.89,81.28 270 top
TB3  95.89,64.14 270 top
TB4  95.89,46.99 270 top
TB5  95.89,29.84 270 top
TB-FAN  3.81,13.34 90 top
TB-RELAY  89.53,3.81 180 top
U2  ADM705  [DIL08']  24.13,29.21 90 top
U3  68.58,70.48 270 top
U4  68.58,50.8 270 top
U5  68.58,31.11 270 top
U$1  52.7,28.57 180 top

### Tracks (layer width: path | path; a pad name or v marks a point on that pad's centre or on a via)
+3V3  (via drill 0.9)
  Top 0.61: R34.P$1 34.92,61.59
  Top 0.813: J1.1 59.69,48.9 59.69,68.58 60.33,69.22 60.33,74.3 60.96,74.93 R38.P$1
  Top 1.27: U$1.38 36.2,33.66 34.92,34.92 34.92,61.59 34.92,78.74 v35.56,79.38 | v46.99,77.47 47.62,76.83 U$1.20
  Bottom 0.813: R36.P$1 R34.P$1
  Bottom 1.27: R38.P$1 60.33,76.83 U$1.20 | v35.56,79.38 45.09,79.38 v46.99,77.47
+5V  (via drill 0.9)
  Top 0.61: v31.75,20.32 29.84,22.23 29.84,26.67 28.57,27.94 U2.2
  Top 0.813: 74.93,58.42 U4.14 | 74.93,38.73 U5.14
  Top 1.016: J2.1 v61.59,45.09
  Top 1.27: U3.14 74.93,78.11 74.93,58.42 74.93,38.73 74.93,15.24 v73.66,15.24
  Bottom 0.254: 49.53,74.3 C5.1
  Bottom 0.61: OK1.8 58.42,89.53 58.42,80.01 | C15.1 68.58,77.47 69.22,78.11 U3.14 | C3.1 68.58,38.1 69.22,38.73 U5.14 | J4.1 66.04,7.62 | 66.04,7.62 59.69,7.62 55.24,3.17 53.98,3.17 | 53.98,3.17 46.99,3.17 | 46.99,3.17 J-AN2.1 | J3.1 53.98,3.17 | v73.66,15.24 74.93,15.24 74.93,8.26 74.3,7.62 66.04,7.62 | R35.P$1 20.95,97.79 19.05,95.89 IC1.3 | U2.2 27.3,27.94 25.4,29.84 25.4,37.47 29.21,41.27 29.21,45.72 29.84,46.35 J-AN.1 | v31.75,20.32 31.75,5.71 33.02,4.45 39.37,4.45 40.64,3.17 46.99,3.17
  Bottom 0.813: C16.1 71.75,58.42 U4.14
  Bottom 1.016: v61.59,45.09 61.59,41.27 62.23,40.64 72.39,40.64 U5.14
  Bottom 1.27: IC1.3 15.88,94.61 17.14,92.71 C4.1 19.05,91.44 21.59,88.9 C2.+ 22.23,87.63 24.77,85.09 44.45,85.09 49.53,80.01 | 49.53,80.01 49.53,74.3 49.53,72.39 50.16,71.75 U$1.18 57.78,71.75 C6.+ | 72.39,80.01 58.42,80.01 R33.P$1 49.53,80.01 | 72.39,80.01 U3.14 | R19.P$2 73.03,86.36 72.39,85.72 72.39,80.01
+12V  (via drill 0.9)
  Top 0.406: v17.78,45.72 17.78,46.35 16.51,47.62 16.51,57.78 17.78,59.05 v17.78,60.96
  Bottom 0.406: R1.P$2 20.95,42.55 v17.78,45.72 | 16.19,78.42 17.78,76.83 v17.78,60.96
  Bottom 1.27: P1.DC+ 18.02,80.25 16.19,78.42 14.61,76.83 7.62,76.83 2.54,81.92 2.54,90.81 3.81,92.08 C1.+ | C1.+ 5.71,93.34 8.26,95.89 IC1.1 | J5.1 10.79,87 C1.+
+UB
  Bottom 0.61: TB1.1 5.71,45.72 6.35,45.09 JP1.2
  Bottom 1.27: P1.AC1 2.71,53.51 1.78,52.32 1.78,46.61 2.54,45.72 TB1.1
-RESET
  Bottom 0.406: R47.P$1 U$1.37 34.29,36.2 33.66,35.56 R46.P$2
AIN-IAC
  Bottom 0.305: J-AN.3 U$1.31
AIN-IBAT
  Bottom 0.254: R32.P$1 34.92,21.59 40.01,26.67 40.01,30.48 40.64,31.11 43.18,31.11 44.45,32.38 44.45,41.27 42.55,42.55 41.27,42.55 40.01,41.27 40.01,38.73 38.73,37.47 35.56,37.47 34.92,38.1 34.92,43.81
  Bottom 0.305: C12.1 33.66,43.18 34.29,43.81 34.92,43.81 U$1.34
  Bottom 0.406: R31.P$1 R32.P$1
AIN-THERM1
  Bottom 0.406: R26.P$1 43.81,53.34 43.18,53.98 U$1.30
AIN-THERM2
  Bottom 0.406: R29.P$1 46.99,55.24 45.72,56.52 U$1.29
AIN-VAC
  Bottom 0.305: J-AN.2 U$1.32
AIN-VBAT
  Bottom 0.305: C9.+ 24.77,67.31 25.4,66.67 R24.P$1 25.4,59.05 26.04,58.42 C8.1 33.02,58.42 33.66,57.78 33.66,53.34 34.29,52.7 38.73,52.7 39.37,52.07 39.37,47.62 38.1,46.35 U$1.33
GND
  Top 0.61: R30.P$2 72.39,2.54 71.12,3.81 65.41,3.81 63.5,1.91 R27.P$2 60.33,3.81 55.88,8.26 41.91,8.26 | T2.1 T3.1 17.78,31.75 17.78,36.2 R2.P$1 | 41.91,8.26 34.92,8.26 | 34.92,8.26 R32.P$2 | J-AN2.3 41.91,8.26 | 34.92,8.26 26.04,8.26 20.32,2.54 8.26,2.54 4.45,6.35 2.79,6.35 1.52,7.62 1.4,46.48 TB1.2 | O2.2 18.41,95.25 | C10.2 48.26,19.68 | P1.AC2 7.79,62.53 7.87,62.61
  Bottom 0.61: LD1.K R30.P$2
  Bottom 1.27: P1.DC0V 7.86,82.31 5.71,84.45 C1.- | TB1.2 4.45,51.27 P1.AC2
  pour Top (isolate 0.61): 21.59,99.06 91.44,99.06 92.71,97.79 92.71,92.71 92.08,92.08 74.93,92.08 71.12,88.27 57.78,88.27 52.7,93.34 22.23,93.34 20.95,94.61 20.95,98.42
  pour Top (isolate 0.61): 0.64,62.23 0.64,99.06 19.05,99.06 19.68,98.42 19.68,93.34 20.95,92.08 51.44,92.08 56.52,87 71.75,87 75.56,90.81 83.82,90.81 85.09,89.53 85.09,11.43 84.45,10.79 22.86,10.79 21.59,12.06 21.59,20.95 17.78,24.77 17.78,43.18 18.41,46.35 18.41,61.59 1.27,61.59
INP-OFF  (via drill 0.9)
  Top 0.406: O2.4 v33.66,82.55
  Bottom 0.406: v33.66,82.55 33.66,81.92 33.02,81.92 29.84,78.74 28.57,78.74 27.94,78.11 27.94,75.56 29.84,73.66 R36.P$2 32.38,69.22 U$1.24 | C14.1 O2.4
INP-ON  (via drill 0.9)
  Top 0.406: O1.4 47.62,88.9 v41.27,82.55
  Bottom 0.406: v41.27,82.55 36.2,82.55 33.02,79.38 33.02,76.83 | 33.02,76.83 R34.P$2 U$1.23 | C13.+ 33.02,76.83
INP-SYNC  (via drill 0.9)
  Top 0.406: v47.62,85.09 45.72,85.09 43.18,82.55 43.18,81.28 42.55,80.64 v42.55,73.03
  Bottom 0.305: U$1.26 38.1,64.14 39.37,65.41 39.37,67.94 42.55,71.12 v42.55,73.03
  Bottom 0.406: OK1.6 60.33,94.61 60.96,93.98 R38.P$2
  Bottom 0.61: OK1.6 57.15,94.61 55.88,93.34 55.88,88.9 53.34,86.36 48.9,86.36 v47.62,85.09
LARGE-L
  Bottom 0.305: U5.1 64.14,38.73 59.69,34.29 56.52,34.29 54.61,32.38 53.34,31.11 U$1.2
LARGE-R
  Bottom 0.305: U5.11 70.48,31.11 69.22,32.38 63.5,32.38 62.23,33.66 57.15,33.66 55.24,31.75 55.24,31.11 U$1.1
LED
  Bottom 0.254: U3.1 64.14,78.11 62.87,77.47 62.87,75.56 61.59,74.3 61.59,73.03 59.05,70.48 48.26,70.48 44.45,74.3 U$1.22
MED-L
  Bottom 0.305: U$1.4 55.24,36.2 55.88,35.56 58.42,35.56 59.69,36.83 59.69,47.62 60.33,48.26 U4.5
MED-R
  Bottom 0.305: U$1.3 54.61,33.66 55.88,34.92 59.05,34.92 60.33,36.2 60.33,46.35 60.96,46.99 68.58,46.99 69.22,47.62 69.22,48.26 71.75,50.8 U4.11
N$1
  Bottom 0.305: U$1.10 J1.2
N$2
  Bottom 0.305: J1.3 U$1.11
N$3
  Bottom 0.305: J1.4 U$1.12
N$4
  Bottom 0.305: J1.5 U$1.13
N$5
  Bottom 0.406: U2.1 26.67,25.4 22.86,29.21 22.86,32.38 22.23,33.02 U2.5
N$6
  Bottom 0.406: U2.4 27.94,34.92 R2.P$2 29.21,38.1 R1.P$1
N$7
  Bottom 0.305: BI-LED.2 92.08,90.81 R20.P$2 R19.P$1
N$8
  Bottom 0.254: U3.2 66.67,75.56 66.93,75.31 69.6,75.31 71.12,76.83 73.66,76.83 75.56,78.74
  Bottom 0.305: 75.56,78.74 75.56,79.38 74.3,80.64 74.3,81.92 75.56,83.19 90.17,83.19 BI-LED.1
N$14
  Bottom 0.61: JP1.3 R21.P$2
N$15
  Bottom 0.254: R3.P$1 78.11,81.28 78.74,80.64 78.74,76.83 77.47,75.56 76.2,75.56 74.93,74.3 74.93,73.66 74.3,73.03 U3.12 68.58,69.22 62.87,69.22 62.87,71.75 64.14,73.03 U3.3
N$16
  Bottom 0.254: U3.4 67.44,73.28 69.85,73.28 70.87,74.3 73.66,74.3 74.93,75.56 74.93,76.83 75.56,77.47 R4.P$1
N$17
  Bottom 0.254: U3.6 67.44,65.41 71.25,69.22
  Bottom 0.305: 71.25,69.22 74.93,69.22 | 74.93,69.22 74.93,71.75 R5.P$1 | U3.9 74.3,65.41 74.93,66.04 74.93,69.22
N$18
  Bottom 0.305: U3.8 73.03,62.87 76.83,66.67 R6.P$1
N$19
  Bottom 0.254: U3.10 72.26,67.94 70.23,65.91 70.23,61.72 70.1,61.59
  Bottom 0.305: U4.1 67.31,58.42 67.94,59.05 67.94,60.96 68.58,61.59 70.1,61.59 74.3,61.59 R7.P$1
N$20
  Bottom 0.305: U4.2 66.67,55.88 71.12,60.33 R8.P$1
N$21
  Bottom 0.305: U4.3 U4.12 73.66,53.34 R9.P$1
N$22
  Bottom 0.305: U4.4 66.04,50.8 67.31,52.07 74.3,52.07 74.93,52.7 R10.P$1
N$23
  Bottom 0.406: R11.P$1 75.56,46.99 74.3,45.72 U4.9 U4.6
N$24
  Bottom 0.406: U4.8 R12.P$1
N$25
  Bottom 0.406: U5.13 73.66,36.2 R13.P$1 78.74,41.27 78.74,47.62 77.47,48.9 75.56,48.9 74.93,48.26 U4.10
N$26
  Bottom 0.406: U5.12 74.93,33.66 R14.P$1
N$27
  Top 0.305: U5.3 U5.2
  Bottom 0.305: U5.3 69.22,33.66 70.48,32.38 76.2,32.38 76.83,31.75 R15.P$1
N$28
  Bottom 0.305: R16.P$1 76.2,26.04 74.93,27.3 68.58,27.3 U5.4
N$29
  Top 0.305: U5.9 U5.10
  Bottom 0.305: U5.9 73.03,26.04 R17.P$1
N$30
  Bottom 0.305: U5.8 72.39,22.86 R18.P$1
N$32
  Top 0.61: JP1.1 3.81,41.91 5.08,43.18 13.34,43.18 14.61,41.91 R22.P$2
N$34
  Bottom 0.254: 18.41,49.53 19.05,48.9 20.32,48.9 20.95,49.53 22.23,49.53 22.86,48.9 R40.E
  Bottom 0.406: R21.P$1 R22.P$1 16.51,51.44 18.41,49.53
N$35
  Bottom 0.406: R27.P$1 R25.P$2 C10.1 53.34,19.05 45.72,26.67 45.72,41.27 45.09,41.91 R26.P$2
N$36
  Bottom 0.61: J4.2 63.5,5.08 66.67,1.91 R28.P$1
N$37
  Top 0.61: J3.2 51.44,3.17 52.7,1.91 R25.P$1
N$38
  Bottom 0.254: R29.P$2 47.62,43.18 46.35,41.91 46.35,27.3 58.42,15.24 60.96,15.24 64.14,12.06 C11.1
  Bottom 0.406: R30.P$1 R28.P$2 67.94,12.06 66.04,10.16 C11.1
N$39
  Bottom 0.61: R33.P$2 51.44,91.44 J-SWON.1
N$40
  Bottom 0.61: TB2.11 89.53,81.28 R3.P$2
N$41
  Top 0.61: R31.P$2 42.55,1.91 44.45,3.81 J-AN2.2
N$42
  Bottom 0.61: O1.1 52.07,97.79 53.98,95.89 J-SWON.2
N$43
  Bottom 0.61: J-SYNCIN.1 85.09,93.34 R37.P$1
N$44
  Bottom 0.61: J-SYNCIN.2 88.9,96.52 88.27,97.16 D1.A 74.93,97.16 73.28,98.81 70.23,98.81 69.85,98.42 69.85,96.52 67.94,94.61 OK1.3
N$45
  Bottom 0.61: R35.P$2 36.83,97.79 37.47,97.16 J-SWOFF.1
N$46
  Bottom 0.61: O2.1 33.66,93.98 35.56,92.08 39.37,92.08 40.01,92.71 J-SWOFF.2
N$47
  Bottom 0.61: D1.C R37.P$2 70.48,92.08 OK1.2
N$49
  Bottom 0.406: LD1.A 76.83,5.71 78.11,6.99 O3.2
N$50
  Bottom 0.406: O3.1 78.11,12.7 80.64,15.24 R39.P$1
N$51
  Bottom 0.406: R42.P$2 18.41,19.68 15.24,22.86 15.24,26.04 12.7,28.57 5.71,28.57 4.45,29.84 4.45,32.38 5.08,33.02 T2.3
  Bottom 0.61: Q1.G 16.51,13.97 18.41,15.88 R42.P$2
N$52
  Top 0.813: O3.3 85.72,8.89 87.63,6.99 95.89,6.99 96.52,7.62 96.52,9.27 Q3.B
N$53
  Bottom 0.254: R41.P$1 43.81,38.73 43.81,33.02 43.18,32.38 34.92,32.38 34.92,24.77 32.38,22.23 19.05,22.23 16.51,24.77 16.51,27.3 13.97,29.84 9.53,29.84
  Bottom 0.406: 9.53,29.84 6.99,29.84 5.71,31.11 5.71,32.38 T2.2
N$54
  Top 1.27: Q2.S 7.62,20.32 6.99,19.68 6.99,16.51 TB-FAN.1
  Bottom 0.61: Q1.S 11.43,8.89 12.06,8.26 R44.P$1 R42.P$1
  Bottom 1.27: TB-FAN.1 3.81,8.89 Q1.S
N$55
  Bottom 0.406: T3.3 9.53,36.2 4.45,36.2 3.17,34.92 3.17,27.94 3.81,27.3 5.71,27.3 7.62,25.4 Q2.G
  Bottom 0.61: R44.P$2 13.34,20.32 13.34,24.77 12.7,25.4 Q2.G
N$56
  Bottom 0.305: U5.6 66.04,26.04 R45.P$2
N$57
  Bottom 1.27: TB-FAN.2 5.08,17.14 6.35,15.88 6.35,12.7 7.62,11.43 Q1.D
N$58
  Bottom 0.406: R43.P$1 12.7,38.1 13.34,37.47 13.34,36.2 13.97,35.56 T3.2
N$59
  Bottom 0.406: J-50HZ.1 61.59,20.32 R45.P$1
N$60
  Bottom 1.27: TB-FAN.3 4.45,20.95 6.35,22.86 Q2.D
N$62
  Bottom 0.61: R4.P$2 87.63,77.47 88.9,76.2 TB2.12
N$63
  Bottom 0.61: R5.P$2 TB2.13
N$64
  Bottom 0.61: R6.P$2 88.27,69.85 89.53,71.12 TB2.14
N$65
  Bottom 0.61: TB3.11 89.53,64.14 R7.P$2
N$66
  Bottom 0.61: R8.P$2 88.9,60.33 90.17,59.05 TB3.12
N$67
  Bottom 0.61: R9.P$2 TB3.13
N$68
  Bottom 0.61: R10.P$2 89.53,52.7 90.81,53.98 TB3.14
N$69
  Bottom 0.61: R11.P$2 89.53,46.99 TB4.11
N$70
  Bottom 0.61: R12.P$2 88.27,43.18 89.53,41.91 TB4.12
N$71
  Bottom 0.61: R13.P$2 TB4.13
N$72
  Bottom 0.61: R14.P$2 87.63,35.56 88.9,36.83 TB4.14
N$73
  Bottom 0.61: R15.P$2 89.53,29.84 TB5.11
N$74
  Bottom 0.61: R16.P$2 88.27,26.04 89.53,24.77 TB5.12
N$75
  Bottom 0.61: R17.P$2 TB5.13
N$76
  Bottom 0.61: R18.P$2 88.9,18.41 90.17,19.68 TB5.14
N$77
  Bottom 0.406: U2.7 22.23,27.94 26.67,23.5 29.84,23.5 R46.P$1
N$78
  Top 0.813: TB-RELAY.2 85.72,5.71 83.82,7.62 83.82,10.16 O3.4
  Bottom 0.813: Q3.C 93.98,12.06 93.34,12.7 D2.A 86.36,12.7 O3.4
N$79
  Bottom 0.813: TB-RELAY.1 92.08,6.35 97.79,6.35 98.42,7.24 D2.C
N$81
  Bottom 0.813: Q3.E 89.53,9.53 87,6.99 85.09,6.99 TB-RELAY.3
N$82
  Bottom 0.406: R40.S 25.4,48.26 26.67,49.53 26.67,52.07 R24.P$2 24.77,52.7 24.13,52.7 22.23,50.8 C7.1
N$84
  Bottom 0.406: R23.P$2 24.13,55.24 29.21,55.24 29.84,54.61 29.84,50.8 27.94,48.9 R40.A
OP-50HZ  (via drill 0.9)
  Top 0.305: v47.62,40.64 47.62,41.91 46.99,42.55 46.99,43.18 45.72,45.09 45.72,47.62 v47.62,49.53 | v40.64,66.67 U$1.25
  Bottom 0.254: v47.62,49.53 48.9,49.53 49.53,50.16 49.53,53.34 50.16,53.98 50.16,57.15 45.72,61.59
  Bottom 0.305: U5.5 63.5,28.57 62.87,29.21 62.87,31.75 61.59,33.02 57.78,33.02 55.88,31.11 55.88,30.48 54.61,29.21 54.61,27.94 53.34,26.67 51.44,26.67 50.8,27.3 50.8,30.48 49.53,31.75 49.53,35.56 47.62,37.47 v47.62,40.64 | 45.72,61.59 v40.64,66.67
OP-SYNCED  (via drill 0.9)
  Top 0.305: U$1.5 54.61,38.73 55.24,38.1 55.24,34.29 v58.42,31.11
  Bottom 0.305: v58.42,31.11 59.69,29.84 59.69,25.4 63.5,21.59 67.31,21.59 69.85,19.05 70.48,19.05 72.39,17.14 74.93,17.14 R39.P$2
PWM-FAN1
  Bottom 0.254: 40.01,58.42 47.62,58.42 49.53,56.52 49.53,54.61 48.26,53.34 48.26,51.44 47.62,50.8 R41.P$2
  Bottom 0.305: U$1.28 39.37,59.05 40.01,58.42
PWM-FAN2  (via drill 0.9)
  Top 0.254: v17.78,55.24 17.78,50.16 v19.68,47.62
  Bottom 0.254: 27.94,62.87 27.94,69.22 25.4,71.75 20.32,71.75 19.05,70.48 19.05,56.52 v17.78,55.24 | v19.68,47.62 18.41,47.62 17.78,48.26 16.51,48.26 15.88,47.62 15.88,45.09 17.14,43.81 17.14,40.64 15.88,39.37 R43.P$2
  Bottom 0.305: U$1.27 36.2,61.59 34.29,63.5 28.57,63.5 27.94,62.87
RX1
  Bottom 0.305: J2.2 56.52,42.55 55.24,43.81 U$1.7
SMALL-L
  Bottom 0.254: 71.5,70.48 67.69,66.67 62.23,66.67 | U$1.35 44.45,48.26 49.53,48.26 50.16,48.9 50.16,52.7 50.8,53.34 50.8,65.41
  Bottom 0.305: U3.11 71.5,70.48 | 50.8,65.41 60.96,65.41 62.23,66.67
SMALL-R
  Bottom 0.254: U$1.36 38.1,38.73 39.37,40.01 39.37,41.91 45.09,47.62 50.16,47.62 50.8,48.26 50.8,52.07 51.44,52.7
  Bottom 0.305: U4.13 71.75,55.88 69.85,53.98 67.31,53.98 66.67,54.61 62.23,54.61 60.33,52.7 51.44,52.7
TINY-L
  Bottom 0.254: U3.13 70.99,75.56 69.72,74.3 63.88,74.3 58.8,69.22 U$1.17
TINY-R
  Bottom 0.254: U3.5 56.52,67.94 55.24,66.67 U$1.16
TX1
  Bottom 0.305: J2.3 56.52,40.01 55.24,41.27 U$1.6

### Text on the board
tPlace: Tiny | Small | -B | +B | 48v | Medium | Mack-e- | - | Large | F2 | stm32 WarpVerter | 201904 | F1 | + | - | -RLY | + | Therm1 | Therm2 | Syncd